# EAGLE schematic uacs-bottom (EAGLE 7.1.0)
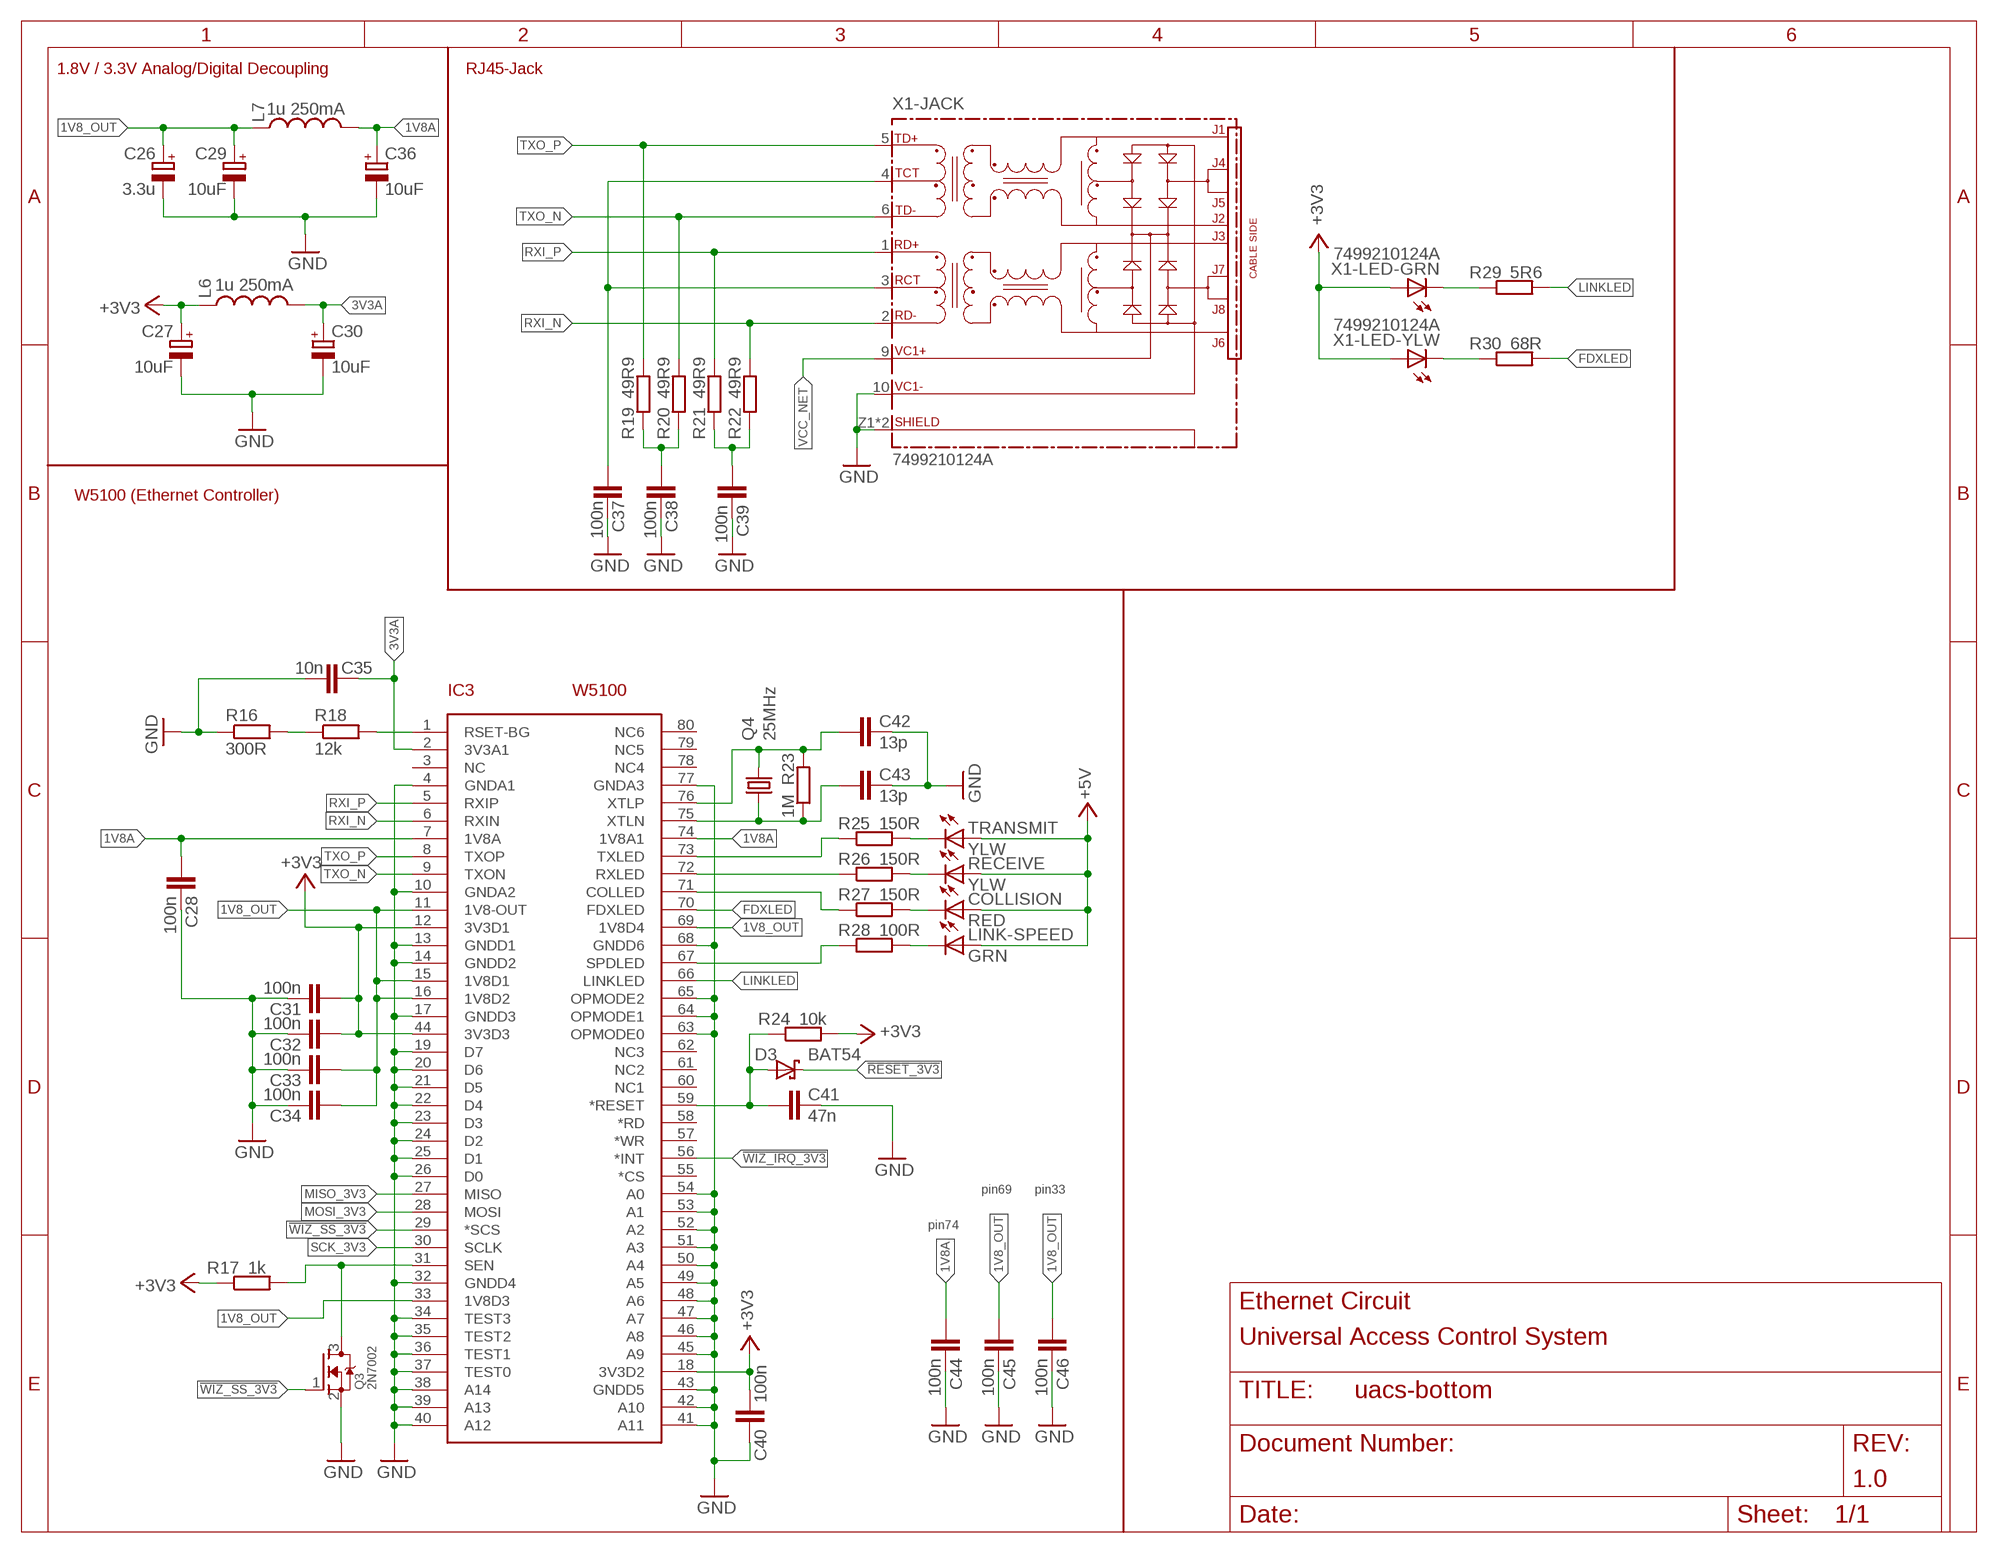
[diagram p0: schematic, sheet 1]

## Parts
C26  3.3u  CPOL-EUB/3528-21R  [B/3528-21R]
C27  10uF  CPOL-EUB/3528-21R  [B/3528-21R]
C28  100n  C-EUC0603  [C0603]
C29  10uF  CPOL-EUB/3528-21R  [B/3528-21R]
C30  10uF  CPOL-EUB/3528-21R  [B/3528-21R]
C31  100n  C-EUC0603  [C0603]
C32  100n  C-EUC0603  [C0603]
C33  100n  C-EUC0603  [C0603]
C34  100n  C-EUC0603  [C0603]
C35  10n  C-EUC0603  [C0603]
C36  10uF  CPOL-EUB/3528-21R  [B/3528-21R]
C37  100n  C-EUC0603  [C0603]
C38  100n  C-EUC0603  [C0603]
C39  100n  C-EUC0603  [C0603]
C40  100n  C-EUC0603  [C0603]
C41  47n  C-EUC0603  [C0603]
C42  13p  C-EUC0603  [C0603]
C43  13p  C-EUC0603  [C0603]
C44  100n  C-EUC0603  [C0603]
C45  100n  C-EUC0603  [C0603]
C46  100n  C-EUC0603  [C0603]
COLLISION  RED  LEDCHIPLED_0603  [CHIPLED_0603]
D3  BAT54  [SOT23]
IC3  W5100  [SQFP-S-10X10-80]
L6  1u 250mA  INDUCTOR0603  [0603]
L7  1u 250mA  INDUCTOR0603  [0603]
LINK-SPEED  GRN  LEDCHIPLED_0603  [CHIPLED_0603]
Q3  2N7002  MOSFET-NREFLOW  [SOT23]
Q4  25MHz  CRYSTALSM49  [SM49]
R16  300R  R-EU_R0603  [R0603]
R17  1k  R-EU_R0603  [R0603]
R18  12k  R-EU_R0603  [R0603]
R19  49R9  R-EU_R0603  [R0603]
R20  49R9  R-EU_R0603  [R0603]
R21  49R9  R-EU_R0603  [R0603]
R22  49R9  R-EU_R0603  [R0603]
R23  1M  R-EU_R0603  [R0603]
R24  10k  R-EU_R0603  [R0603]
R25  150R  R-EU_R0603  [R0603]
R26  150R  R-EU_R0603  [R0603]
R27  150R  R-EU_R0603  [R0603]
R28  100R  R-EU_R0603  [R0603]
R29  5R6  R-EU_R0603  [R0603]
R30  68R  R-EU_R0603  [R0603]
RECEIVE  YLW  LEDCHIPLED_0603  [CHIPLED_0603]
TRANSMIT  YLW  LEDCHIPLED_0603  [CHIPLED_0603]
X1  7499210124A  [7499210124A]

## Nets
1V8_OUT: C26.+ C29.+ C33.1 C34.1 C45.1 C46.1 IC3.11(1V8-OUT) IC3.15(1V8D1) IC3.16(1V8D2) IC3.33(1V8D3) IC3.69(1V8D4) L7.1
1V8A: C28.1 C36.+ C44.1 IC3.7(1V8A) IC3.74(1V8A1) L7.2
3V3A: C30.+ C35.1 IC3.2(3V3A1) L6.2
!RESET_3V3: D3.3(C)
!WIZ_IRQ_3V3: IC3.56(*INT)
!WIZ_SS_3V3: IC3.29(*SCS) Q3.1(G)
+3V3: C27.+ C31.1 C32.1 C40.1 IC3.12(3V3D1) IC3.18(3V3D2) IC3.44(3V3D3) L6.1 R17.1 R24.2 X1.12(-LED-GRN:A) X1.14(-LED-YLW:A)
+5V: COLLISION.A LINK-SPEED.A RECEIVE.A TRANSMIT.A
FDXLED: IC3.70(FDXLED) R30.2
GND: C26.- C27.- C28.2 C29.- C30.- C31.2 C32.2 C33.2 C34.2 C35.2 C36.- C37.2 C38.2 C39.2 C40.2 C41.2 C42.2 C43.2 C44.2 C45.2 C46.2 IC3.4(GNDA1) IC3.10(GNDA2) IC3.13(GNDD1) IC3.14(GNDD2) IC3.17(GNDD3) IC3.19(D7) IC3.20(D6) IC3.21(D5) IC3.22(D4) IC3.23(D3) IC3.24(D2) IC3.25(D1) IC3.26(D0) IC3.32(GNDD4) IC3.34(TEST3) IC3.35(TEST2) IC3.36(TEST1) IC3.37(TEST0) IC3.38(A14) IC3.39(A13) IC3.40(A12) IC3.41(A11) IC3.42(A10) IC3.43(GNDD5) IC3.45(A9) IC3.46(A8) IC3.47(A7) IC3.48(A6) IC3.49(A5) IC3.50(A4) IC3.51(A3) IC3.52(A2) IC3.53(A1) IC3.54(A0) IC3.63(OPMODE0) IC3.64(OPMODE1) IC3.65(OPMODE2) IC3.68(GNDD6) IC3.77(GNDA3) Q3.2(S) R16.1 X1.10(-JACK:VC1-) X1.Z1(-JACK:SHIELD) X1.Z2(-JACK:SHIELD)
LINKLED: IC3.66(LINKLED) R29.2
MISO_3V3: IC3.27(MISO)
MOSI_3V3: IC3.28(MOSI)
N$15: IC3.1(RSET-BG) R18.2
N$16: R30.1 X1.13(-LED-YLW:C)
N$17: R29.1 X1.11(-LED-GRN:C)
N$18: C41.1 D3.1(A) IC3.59(*RESET) R24.1
N$19: C39.1 R21.1 R22.1
N$20: R25.2 TRANSMIT.C
N$21: C38.1 R19.1 R20.1
N$22: IC3.67(SPDLED) R28.1
N$23: R26.2 RECEIVE.C
N$24: IC3.71(COLLED) R27.1
N$25: IC3.72(RXLED) R26.1
N$26: IC3.73(TXLED) R25.1
N$27: COLLISION.C R27.2
N$28: LINK-SPEED.C R28.2
N$29: C43.1 IC3.75(XTLN) Q4.1 R23.1
N$30: C42.1 IC3.76(XTLP) Q4.2 R23.2
N$44: R16.2 R18.1
RXI_N: IC3.6(RXIN) R22.2 X1.2(-JACK:RD-)
RXI_P: IC3.5(RXIP) R21.2 X1.1(-JACK:RD+)
SCK_3V3: IC3.30(SCLK)
SEN: IC3.31(SEN) Q3.3(D) R17.2
TXCT: C37.1 X1.3(-JACK:RCT) X1.4(-JACK:TCT)
TXO_N: IC3.9(TXON) R20.2 X1.6(-JACK:TD-)
TXO_P: IC3.8(TXOP) R19.2 X1.5(-JACK:TD+)
VCC_NET: X1.9(-JACK:VC1+)
Unconnected: IC3.3(NC) IC3.55(*CS) IC3.57(*WR) IC3.58(*RD) IC3.60(NC1) IC3.61(NC2) IC3.62(NC3) IC3.78(NC4) IC3.79(NC5) IC3.80(NC6)

## Notes on the sheet
- 1.8V / 3.3V Analog/Digital Decoupling | RJ45-Jack
- W5100 (Ethernet Controller)
- pin69 | pin33
- pin74
- Ethernet Circuit
- Universal Access Control System
- 1.0

## Library data of the parts
C26 C27 C29 C30 C36 = rcl:CPOL-EU: POLARIZED CAPACITOR, European symbol
C28 C31-C35 C37-C46 = rcl:C-EU: CAPACITOR, European symbol
COLLISION LINK-SPEED RECEIVE TRANSMIT = adafruit:LED: LED OSRAM: - CHIPLED LG R971, LG N971, LY N971, LG Q971, LY Q971, LO R971, LY R971 LH N974, LH R974 LS Q976, LO Q976, LY Q976 LO Q996 - Hyper CHIPLED LW Q18S LB Q993, LB Q99A, LB R99A - SideLED LS A670, LO A670, LY A670, LG A670, LP A670 LB A673, LV A673, LT A673, LW A673 LH A674 LY A675 LS A676, LA A676, LO A676, LY A676, LW A676 LS A679, LY A679, LG A679 - Hyper Micro SIDELED® LS Y876, LA Y876, LO Y876, LY Y876 LT Y87S - SmartLED LW L88C, LW L88S LB L89C, LB L89S, LG L890 LS L89K, LO L89K, LY L89K LS L896, LA L896, LO L896, LY L896 - TOPLED LS T670, LO T670, LY T670, LG T670, LP T670 LSG T670, LSP T670, LSY T670, LOP T670, LYG T670 LG T671, LOG T671, LSG T671 LB T673, LV T673, LT T673, LW T673 LH T674 LS T676, LA T676, LO T676, LY T676, LB T676, LH T676, LSB T676, LW T676 LB T67C, LV T67C, LT T67C, LS T67K, LO T67K, LY T67K, LW E67C LS E67B, LA E67B, LO E67B, LY E67B, LB E67C, LV E67C, LT E67C LW T67C LS T679, LY T679, LG T679 LS T770, LO T770, LY T770, LG T770, LP T770 LB T773, LV T773, LT T773, LW T773 LH T774 LS E675, LA E675, LY E675, LS T675 LS T776, LA T776, LO T776, LY T776, LB T776 LHGB T686 LT T68C, LB T68C - Hyper Mini TOPLED® LB M676 - Mini TOPLED Santana® LG M470 LS M47K, LO M47K, LY M47K Source: http://www.osram.convergy.de/
D3 = diode:BAT54: Schottky Diodes Source: Fairchild .. BAT54.pdf
IC3 = SmartPrj:W5100
L6 L7 = SparkFun-Passives:INDUCTOR: Inductors Basic Inductor/Choke - 0603 and 1206. Footprints are not proven and vary greatly between part numbers. SRN6045- 33uH, 20% 1.4A SDR0403-560KL - 56uH, 10%, 500mA RMS/740mA peak
Q3 = adafruit:MOSFET-N: N-Channel Mosfet 2N7002E - 60V 260mA SOT23 [Digikey: 2N7002ET1GOSTR-ND] - REEL BSH103 - 30V 850mA SOT23 [Digikey: 568-5013-1-ND]
Q4 = adafruit:CRYSTAL: CRYSTAL; OC_FARNELL: unknown; OC_NEWARK: unknown
R16-R30 = rcl:R-EU_: RESISTOR, European symbol
X1 = 7499210124A:7499210124A: LAN-Übertrager WE-RJ45LAN 10/100BaseT PoE Wuerth 7499210124A Datasheet: http://www.mouser.com/ds/2/445/7499210124A-254273.pdf